# Altium schematic sheet ESP12_RGBW_01.SchDoc: ESP12_RGBW
size A3; Date: 19/04/2016; DrawnBy: Wim Van Gool; Revision: 01; SheetNumber: 1; SheetTotal: 1; PageSetup: Record=PageOptions|CenterHorizontal=True|CenterVertical=True|PrintScale=0.70|XCorrection=1.00|YCorrection=1.00|PrintKind=1|BorderSize=5000000|LeftOffset=0|BottomOffset=0|Orientation=2|PaperLength=1000|PaperWidth=1000|Scale=100|PaperSource=15|PrintQuality=600|MediaType=1|DitherType=10|PrintScaleMode=1|PaperKind=A4 (210 x 297 mm)|PaperIndex=9
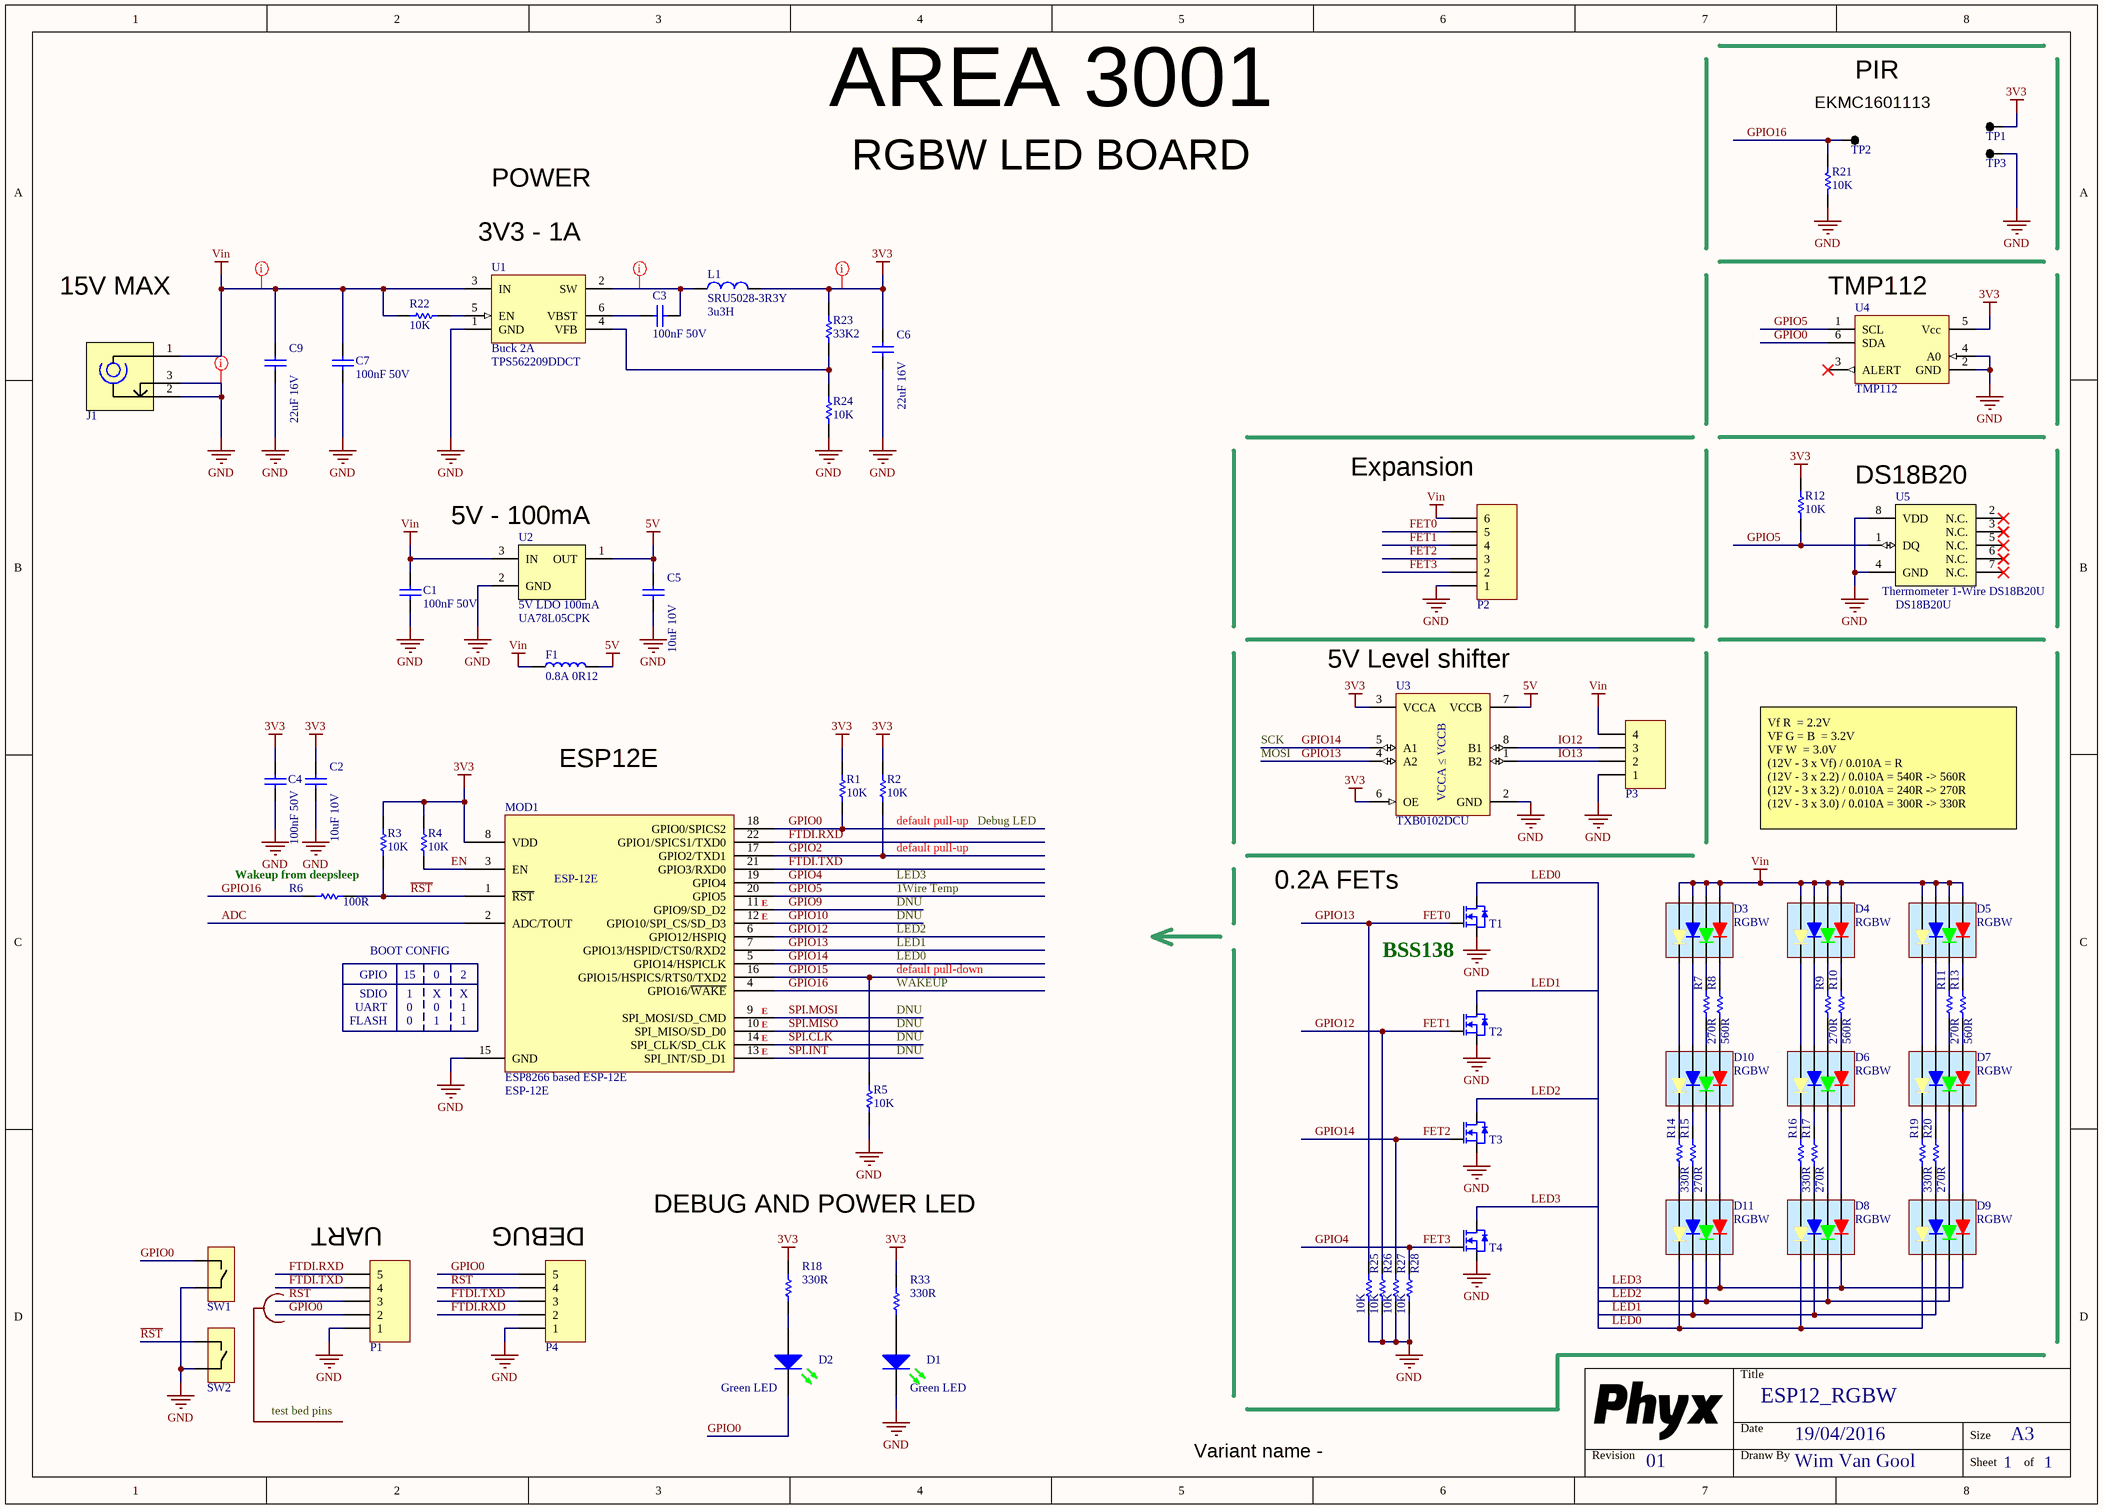
[diagram p0: ESP12_RGBW_01.SchDoc]

## Parts
C1  value 100nF 50V  [C0603_N]  (hidden comment: CAP_CERAMIC)
C2  value 10uF 10V  [C0805_N]  (hidden comment: CAP_CERAMIC)
C3  value 100nF 50V  [C0603_N]  (hidden comment: CAP_CERAMIC)
C4  value 100nF 50V  [C0603_N]  (hidden comment: CAP_CERAMIC)
C5  value 10uF 10V  [C0805_N]  (hidden comment: CAP_CERAMIC)
C6  value 22uF 16V  [C1206_N]  (hidden comment: CAP_CERAMIC)
C7  value 100nF 50V  [C0603_N]  (hidden comment: CAP_CERAMIC)
C9  value 22uF 16V  [C1206_N]  (hidden comment: CAP_CERAMIC)
D1  Green LED  [LED_0805_GR]
D2  Green LED  [LED_0805_GR]
D3  value RGBW  [LED_5050_RGBW_PLCC8]  (hidden comment: 5050 RGBW LED)
D4  value RGBW  [LED_5050_RGBW_PLCC8]  (hidden comment: 5050 RGBW LED)
D5  value RGBW  [LED_5050_RGBW_PLCC8]  (hidden comment: 5050 RGBW LED)
D6  value RGBW  [LED_5050_RGBW_PLCC8]  (hidden comment: 5050 RGBW LED)
D7  value RGBW  [LED_5050_RGBW_PLCC8]  (hidden comment: 5050 RGBW LED)
D8  value RGBW  [LED_5050_RGBW_PLCC8]  (hidden comment: 5050 RGBW LED)
D9  value RGBW  [LED_5050_RGBW_PLCC8]  (hidden comment: 5050 RGBW LED)
D10  value RGBW  [LED_5050_RGBW_PLCC8]  (hidden comment: 5050 RGBW LED)
D11  value RGBW  [LED_5050_RGBW_PLCC8]  (hidden comment: 5050 RGBW LED)
F1  value 0.8A 0R12  [L0805]  (hidden comment: FERRITE)
J1  Socket RA 3.5 with 1.35 barrel  [DC-003]  (value not drawn)
L1  SRU5028-3R3Y  value 3u3H  [BRNS_SRU5028]
MOD1  ESP8266 based ESP-12E  value ESP-12E  [ESP-12E]
P1  Header 5  [HDR1X5]  (value not drawn)
P2  Header 6  [HDR1X6]  (value not drawn)
P3  Header 4  [HDR1X4]  (value not drawn)
P4  Header 1.0mm RA Shrouded 5  [WE_665105131822]  (value not drawn)
R1  value 10K  [R0603_N]  (hidden comment: RESISTOR)
R2  value 10K  [R0603_N]  (hidden comment: RESISTOR)
R3  value 10K  [R0603_N]  (hidden comment: RESISTOR)
R4  value 10K  [R0603_N]  (hidden comment: RESISTOR)
R5  value 10K  [R0603_N]  (hidden comment: RESISTOR)
R6  value 100R  [R0603_N]  (hidden comment: RESISTOR)
R7  value 270R  [R0603_N]  (hidden comment: RESISTOR)
R8  value 560R  [R0603_N]  (hidden comment: RESISTOR)
R9  value 270R  [R0603_N]  (hidden comment: RESISTOR)
R10  value 560R  [R0603_N]  (hidden comment: RESISTOR)
R11  value 270R  [R0603_N]  (hidden comment: RESISTOR)
R12  value 10K  [R0603_N]  (hidden comment: RESISTOR)
R13  value 560R  [R0603_N]  (hidden comment: RESISTOR)
R14  value 330R  [R0603_N]  (hidden comment: RESISTOR)
R15  value 270R  [R0603_N]  (hidden comment: RESISTOR)
R16  value 330R  [R0603_N]  (hidden comment: RESISTOR)
R17  value 270R  [R0603_N]  (hidden comment: RESISTOR)
R18  value 330R  [R0603_N]  (hidden comment: RESISTOR)
R19  value 330R  [R0603_N]  (hidden comment: RESISTOR)
R20  value 270R  [R0603_N]  (hidden comment: RESISTOR)
R21  value 10K  [R0603_N]  (hidden comment: RESISTOR)
R22  value 10K  [R0603_N]  (hidden comment: RESISTOR)
R23  value 33K2  [R0603_N]  (hidden comment: RESISTOR)
R24  value 10K  [R0603_N]  (hidden comment: RESISTOR)
R25  value 10K  [R0603_N]  (hidden comment: RESISTOR)
R26  value 10K  [R0603_N]  (hidden comment: RESISTOR)
R27  value 10K  [R0603_N]  (hidden comment: RESISTOR)
R28  value 10K  [R0603_N]  (hidden comment: RESISTOR)
R33  value 330R  [R0603_N]  (hidden comment: RESISTOR)
SW1  LP SMD tact sw  [CK_KMR4]  (value not drawn)
SW2  LP SMD tact sw  [CK_KMR4]  (value not drawn)
T1  0.2A N-Ch MOSFET Vgs 3.2  [SOT23-3]  (value not drawn)
T2  0.2A N-Ch MOSFET Vgs 3.2  [SOT23-3]  (value not drawn)
T3  0.2A N-Ch MOSFET Vgs 3.2  [SOT23-3]  (value not drawn)
T4  0.2A N-Ch MOSFET Vgs 3.2  [SOT23-3]  (value not drawn)
TP1  TEST_PAD  [TP_0.8mm_0.4mm]  (value not drawn)
TP2  TEST_PAD  [TP_0.8mm_0.4mm]  (value not drawn)
TP3  TEST_PAD  [TP_0.8mm_0.4mm]  (value not drawn)
U1  Buck 2A  value TPS562209DDCT  [TI_DDC_R-PDSO-G6]
U2  5V LDO 100mA  value UA78L05CPK  [TI_PK]
U3  value TXB0102DCU  [TI_DCU_R-PDSO-G8]  (hidden comment: 2-bit Bi Level translator, 15kV ESD)
U4  value TMP112  [TI_DRL_R-PDSO-N6]  (hidden comment: I2C Temp sensor High Accuracy)
U5  Thermometer 1-Wire DS18B20U  value DS18B20U  [MAX_uSOP8]

## Nets
3V3: C2.1 C4.1 C6.1 L1.2 MOD1.8(VDD) R1.1 R2.1 R3.1 R4.1 R12.1 R18.1 R23.1 R33.1 TP1.1 U3.3(VCCA) U3.6(OE) U4.5(Vcc)
5V: C5.1 F1.2 U2.1(OUT) U3.7(VCCB)
GND: C1.2 C2.2 C4.2 C5.2 C6.2 C7.1 C9.2 D1.2(K) J1.2 J1.3 MOD1.15(GND) P1.1 P2.1 P3.1 P4.1 R5.2 R21.2 R24.2 R25.2 R26.2 R27.2 R28.2 SW1.2 SW2.2 T1.2(S) T2.2(S) T3.2(S) T4.2(S) TP3.1 U1.1(GND) U2.2(GND) U3.2(GND) U4.2(GND) U4.4(A0) U5.4(GND) U5.8(VDD)
Vin: C1.1 C7.2 C9.1 D3.1(RA) D3.3(GA) D3.5(BA) D3.7(WA) D4.1(RA) D4.3(GA) D4.5(BA) D4.7(WA) D5.1(RA) D5.3(GA) D5.5(BA) D5.7(WA) F1.1 J1.1 P2.6 P3.4 R22.1 U1.3(IN) U2.3(IN)
ADC: MOD1.2(ADC/TOUT)
EN: MOD1.3(EN) R4.2
FET0: MOD1.7(GPIO13/HSPID/CTS0/RXD2) P2.5 R25.1 T1.1(G) U3.4(A2)  [also labelled GPIO13]
FET1: MOD1.6(GPIO12/HSPIQ) P2.4 R26.1 T2.1(G)  [also labelled GPIO12]
FET2: MOD1.5(GPIO14/HSPICLK) P2.3 R27.1 T3.1(G) U3.5(A1)  [also labelled GPIO14]
FET3: MOD1.19(GPIO4) P2.2 R28.1 T4.1(G)  [also labelled GPIO4]
FTDI.RXD: MOD1.22(GPIO1/SPICS1/TXD0) P1.5 P4.2
FTDI.TXD: MOD1.21(GPIO3/RXD0) P1.4 P4.3
GPIO0: D2.2(K) MOD1.18(GPIO0/SPICS2) P1.2 P4.5 R1.2 SW1.1 U4.6(SDA)
GPIO2: MOD1.17(GPIO2/TXD1) R2.2
GPIO5: MOD1.20(GPIO5) R12.2 U4.1(SCL) U5.1(DQ)
GPIO9: MOD1.11(GPIO9/SD_D2)
GPIO10: MOD1.12(GPIO10/SPI_CS/SD_D3)
GPIO15: MOD1.16(GPIO15/HSPICS/RTS0/TXD2) R5.1
GPIO16: MOD1.4(GPIO16/~{WAKE}) R6.2 R21.1 TP2.1
IO12: P3.3 U3.8(B1)
IO13: P3.2 U3.1(B2)
LED0: D8.8(WC) D9.8(WC) D11.8(WC) T1.3(D)
LED1: D8.6(BC) D9.6(BC) D11.6(BC) T2.3(D)
LED2: D8.4(GC) D9.4(GC) D11.4(GC) T3.3(D)
LED3: D8.2(RC) D9.2(RC) D11.2(RC) T4.3(D)
~{RST}: MOD1.1(~{RST}) P1.3 P4.4 R3.2 R6.1 SW2.1
SPI.CLK: MOD1.14(SPI_CLK/SD_CLK)
SPI.INT: MOD1.13(SPI_INT/SD_D1)
SPI.MISO: MOD1.10(SPI_MISO/SD_D0)
SPI.MOSI: MOD1.9(SPI_MOSI/SD_CMD)
NetC3_1: C3.1 U1.6(VBST)
NetC3_2: C3.2 L1.1 U1.2(SW)
NetD1_1: D1.1(A) R33.2
NetD2_1: D2.1(A) R18.2
NetD3_2: D3.2(RC) R8.1
NetD3_4: D3.4(GC) R7.1
NetD3_6: D3.6(BC) D10.5(BA)
NetD3_8: D3.8(WC) D10.7(WA)
NetD4_2: D4.2(RC) R10.1
NetD4_4: D4.4(GC) R9.1
NetD4_6: D4.6(BC) D6.5(BA)
NetD4_8: D4.8(WC) D6.7(WA)
NetD5_2: D5.2(RC) R13.1
NetD5_4: D5.4(GC) R11.1
NetD5_6: D5.6(BC) D7.5(BA)
NetD5_8: D5.8(WC) D7.7(WA)
NetD6_1: D6.1(RA) R10.2
NetD6_2: D6.2(RC) D8.1(RA)
NetD6_3: D6.3(GA) R9.2
NetD6_4: D6.4(GC) D8.3(GA)
NetD6_6: D6.6(BC) R17.1
NetD6_8: D6.8(WC) R16.1
NetD7_1: D7.1(RA) R13.2
NetD7_2: D7.2(RC) D9.1(RA)
NetD7_3: D7.3(GA) R11.2
NetD7_4: D7.4(GC) D9.3(GA)
NetD7_6: D7.6(BC) R20.1
NetD7_8: D7.8(WC) R19.1
NetD8_5: D8.5(BA) R17.2
NetD8_7: D8.7(WA) R16.2
NetD9_5: D9.5(BA) R20.2
NetD9_7: D9.7(WA) R19.2
NetD10_1: D10.1(RA) R8.2
NetD10_2: D10.2(RC) D11.1(RA)
NetD10_3: D10.3(GA) R7.2
NetD10_4: D10.4(GC) D11.3(GA)
NetD10_6: D10.6(BC) R15.1
NetD10_8: D10.8(WC) R14.1
NetD11_5: D11.5(BA) R15.2
NetD11_7: D11.7(WA) R14.2
NetR22_2: R22.2 U1.5(EN)
NetR23_2: R23.2 R24.1 U1.4(VFB)

Not connected (* = marked no-connect by the designer): U4 3(ALERT)*; U5 2(N.C.)* 3(N.C.)* 5(N.C.)* 6(N.C.)* 7(N.C.)*

## Layout directives
net class POWER: 3V3, GND, NetC3_2, Vin

## Notes on the sheet
- (near TP2) EKMC1601113
- PIR
- AREA 3001
- RGBW LED BOARD
- (near U1) 3V3 - 1A
- POWER
- 15V MAX
- (near U4) TMP112
- (near P2) Expansion
- (near U5) DS18B20
- (near U2) 5V - 100mA
- (near U3) 5V Level shifter
- ESP12E
- SCK
- MOSI
- (near R2) default pull-up
- default pull-up
- Debug LED
- Vf R 	= 2.2V
  VF G = B 	= 3.2V
  VF W 	= 3.0V
  (12V - 3 x Vf) / 0.010A = R
  (12V - 3 x 2.2) / 0.010A = 540R -> 560R
  (12V - 3 x 3.2) / 0.010A = 240R -> 270R
  (12V - 3 x 3.0) / 0.010A = 300R -> 330R
- (near R6) Wakeup from deepsleep
- (near MOD1) E
- DNU
- 1Wire Temp
- LED3
- 0.2A FETs
- GPIO
- SDIO
- 15
- 1
- BOOT CONFIG
- 0
- X
- (near MOD1) 2
- (near MOD1) X
- default pull-down
- WAKEUP
- LED0
- LED1
- LED2
- (near T1) BSS138
- UART
- FLASH
- (near MOD1) 1
- (near R5) DNU
- (near P1) UART
- (near P4) DEBUG
- DEBUG AND POWER LED
- Title
- test bed pins
- Variant name -
- Revision
- Date
- Dranw By
- Size
- A3
- Sheet
- of
- (in symbol LVL # 2ch TXB0102DCU) VCCA ≤ VCCB

## Library data of the parts
C1 C3 C4 C7 = CAP # 100nF 50V 0603: Capacitor Ceramic; Supplier 1: Farnell; Supplier Part Number 1: 1759122
C2 C5 = CAP # 10uF 10V 0805: Capacitor Ceramic; Supplier 1: Farnell; Supplier Part Number 1: 2320859
C6 C9 = CAP # 22uF 16V 1206 X5R: Capacitor Ceramic; Supplier 1: Farnell; Supplier Part Number 1: 2320923
D1 D2 = LED # Green 0805: =Description; Supplier 1: Farnell; Supplier Part Number 1: 2099239
D3-D11 = LED # RGBW 5050: =Description; Supplier 1: Aliexpress
F1 = FER # 120R 0.8A 0805 0R12: Supplier 1: Farnell; Supplier Part Number 1: 1669728
J1 = SCKT 1.35mm barrel 3.5mm dia: =Description; Value: DC-003; Supplier 1: China; Description: SCKT 1.35mm barrel 3.5mm dia
L1 = IND # 3u3H 5.2x5.2mm: Supplier 1: Farnell; Supplier Part Number 1: 1362085
MOD1 = WiFi # MOD ESP-12E: =Description
P1 = Pin Header 2.54mm 5way
P2 = Pin Header 2.54mm 6way
P3 = Pin Header 2.54mm 4way
P4 = HDR # RA SHR 1.0mm 2way - 665105131822: Value: 665105131822
R1-R5 R12 R21 R22 R24-R28 = RES # 10K 0603
R6 = RES # 100R 0603
R7 R9 R11 R15 R17 R20 = RES # 270R 0603
R8 R10 R13 = RES # 560R 0603
R14 R16 R18 R19 R33 = RES # 330R 0603
R23 = RES # 33K2 0603: Supplier 1: Farnell; Supplier Part Number 1: 2331150
SW1 SW2 = SW # KMR4: Value: KMR442GULCLFS; Supplier 1: Farnell
T1-T4 = BSS138 N-Ch MOSFET 0.2A 3.2Vgs 60Vds: Value: BSS138; Supplier 1: Farnell; Supplier Part Number 1: 2432717; Description: BSS138 N-Ch MOSFET 0.2A 3.2Vgs 60Vds
TP1-TP3 = TP 0.8mm: Value: NO BOM
U1 = PWR # Buck TPS562209 2A: =Description; Supplier 1: Farnell; Supplier Part Number 1: 2420236
U2 = LDO # 5V 100mA: LDO 5V 100mA; Supplier 1: Farnell; Supplier Part Number 1: 2112604
U3 = LVL # 2ch TXB0102DCU: =Description; Supplier 1: Farnell
U4 = TEMP # TMP112: =Description; Supplier 1: Farnell; Supplier Part Number 1: 1735574
U5 = TMP # DS18B20U: =Description; Supplier 1: Farnell; Supplier Part Number 1: 1379725